# Altium project PCB_Project1.PrjPCB
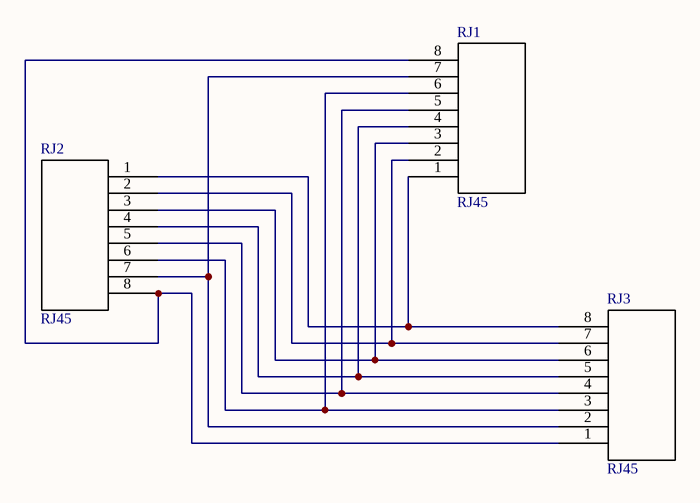
[diagram p0: TesteRJ45.SchDoc]
2 sheets, 12 parts. Net scope: global (net labels, ports and power ports of the same name join across sheets).
Board files: PCB1.PcbDoc, PCB2.PcbDoc
Sheets:
  TesteRJ45.SchDoc
  TesteKK.SchDoc

## Sheet TesteRJ45.SchDoc
size A4

### Parts
RJ1  RJ45  [RJ45_Simples]
RJ2  RJ45  [RJ45_Simples]
RJ3  RJ45  [RJ45_Simples]

### Nets
NetRJ1_1: RJ1.1 RJ2.1 RJ3.8
NetRJ1_2: RJ1.2 RJ2.2 RJ3.7
NetRJ1_3: RJ1.3 RJ2.3 RJ3.6
NetRJ1_4: RJ1.4 RJ2.4 RJ3.5
NetRJ1_5: RJ1.5 RJ2.5 RJ3.4
NetRJ1_6: RJ1.6 RJ2.6 RJ3.3
NetRJ1_7: RJ1.7 RJ2.7 RJ3.2
NetRJ1_8: RJ1.8 RJ2.8 RJ3.1

## Sheet TesteKK.SchDoc
size A4
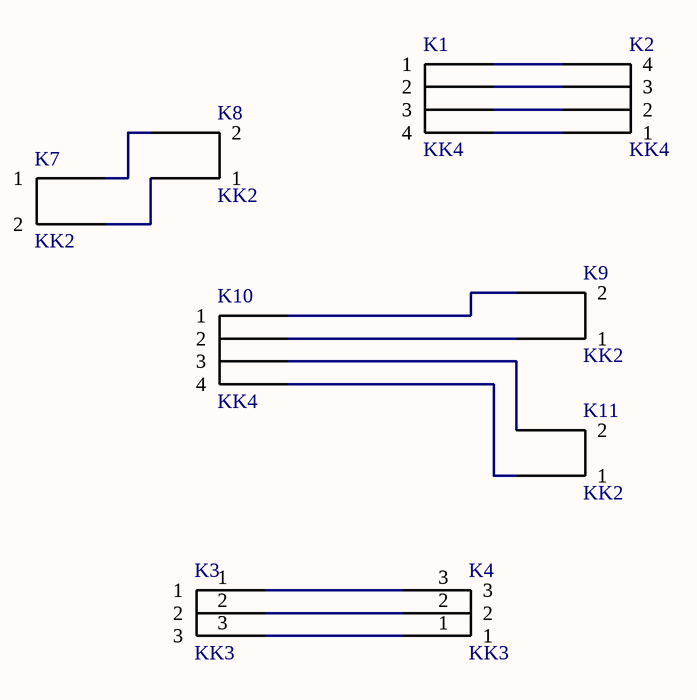
[diagram p1: TesteKK.SchDoc]

### Parts
K1  KK4  [4-vias]
K2  KK4  [4-vias]
K3  KK3  [3-vias]
K4  KK3  [3-vias]
K7  KK2  [2-vias]
K8  KK2  [2-vias]
K9  KK2  [2-vias]
K10  KK4  [4-vias]
K11  KK2  [2-vias]

### Nets
NetK1_1: K1.1 K2.4
NetK1_2: K1.2 K2.3
NetK1_3: K1.3 K2.2
NetK1_4: K1.4 K2.1
NetK3_1: K3.1 K4.3
NetK3_2: K3.2 K4.2
NetK3_3: K3.3 K4.1
NetK7_1: K7.1 K8.2
NetK7_2: K7.2 K8.1
NetK9_1: K9.1 K10.2
NetK9_2: K9.2 K10.1
NetK10_3: K10.3 K11.2
NetK10_4: K10.4 K11.1

### Library data of the parts
K1 K2 K10 = KK4Vias: ComponentLink1Description: Fabricante; ComponentLink1URL: https://www.molex.com/molex/products/family?key=kk_254_rpc_connector_system&channel=products&chanName=family&pageTitle=Introduction&parentKey=kk_interconnect_solutions
K3 K4 = KK3Vias
K7-K9 K11 = KK2Vias